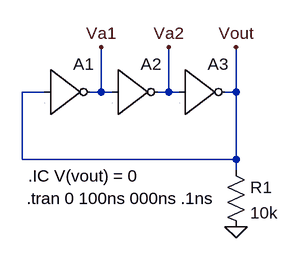
[diagram p0: schematic Draft3.asc]
Draft3.asc, the LTspice schematic file:
Version 4
SHEET 1 880 680
WIRE 80 144 48 144
WIRE 160 144 160 80
WIRE 160 144 144 144
WIRE 176 144 160 144
WIRE 256 144 256 80
WIRE 256 144 240 144
WIRE 272 144 256 144
WIRE 352 144 352 80
WIRE 352 144 336 144
WIRE 48 240 48 144
WIRE 352 240 352 144
WIRE 352 240 48 240
WIRE 352 256 352 240
FLAG 352 336 0
FLAG 160 80 Va1
FLAG 256 80 Va2
FLAG 352 80 Vout
SYMBOL Digital\\inv 80 80 R0
WINDOW 3 8 104 Invisible 2
SYMATTR InstName A1
SYMATTR Value Vlow = 0.2, Vhigh = 4.0
SYMATTR Value2 Trise = 8ns, Tfall = 4nS, Td = 2ns
SYMBOL res 336 240 R0
SYMATTR InstName R1
SYMATTR Value 10k
SYMBOL Digital\\inv 176 80 R0
WINDOW 3 8 104 Invisible 2
SYMATTR InstName A2
SYMATTR Value Vlow = 0.2, Vhigh = 4.0
SYMATTR Value2 Trise = 8ns, Tfall = 4nS, Td = 2ns
SYMBOL Digital\\inv 272 80 R0
WINDOW 3 8 104 Invisible 2
SYMATTR InstName A3
SYMATTR Value Vlow = 0.2, Vhigh = 4.0
SYMATTR Value2 Trise = 8ns, Tfall = 4nS, Td = 2ns
TEXT 56 264 Left 2 !.IC V(vout) = 0
TEXT 54 296 Left 2 !.tran 0 100ns 000ns .1ns

The netlist it stands for:
* Draft3.asc
A1 Vout 0 0 0 0 Va1 0 0 BUF Vlow = 0.2, Vhigh = 4.0 Trise = 8ns, Tfall = 4nS, Td = 2ns
R1 Vout 0 10k
A2 Va1 0 0 0 0 Va2 0 0 BUF Vlow = 0.2, Vhigh = 4.0 Trise = 8ns, Tfall = 4nS, Td = 2ns
A3 Va2 0 0 0 0 Vout 0 0 BUF Vlow = 0.2, Vhigh = 4.0 Trise = 8ns, Tfall = 4nS, Td = 2ns
.IC V(vout) = 0
.tran 0 100ns 000ns .1ns
.backanno
.end